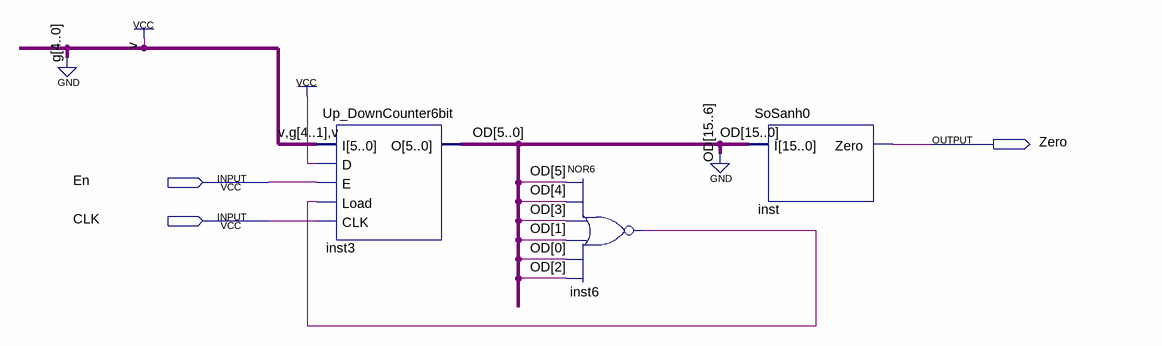
[diagram p0: schematic sheet]
// Quartus schematic Counter.bdf as structural Verilog: 3 symbols, 3 pins
module Counter (
  input  En,
  input  CLK,
  output Zero
);

  wire inst6_out;
  wire [5:0] OD;

  Up_DownCounter6bit inst3 (.I(6'b100001), .D(1'b1), .E(En), .Load(inst6_out), .CLK(CLK), .O(OD));
  nor inst6 (inst6_out, OD[5], OD[4], OD[3], OD[1], OD[0], OD[2]);
  SoSanh0 inst (.I({{10{1'b0}}, OD}), .Zero(Zero));
endmodule
